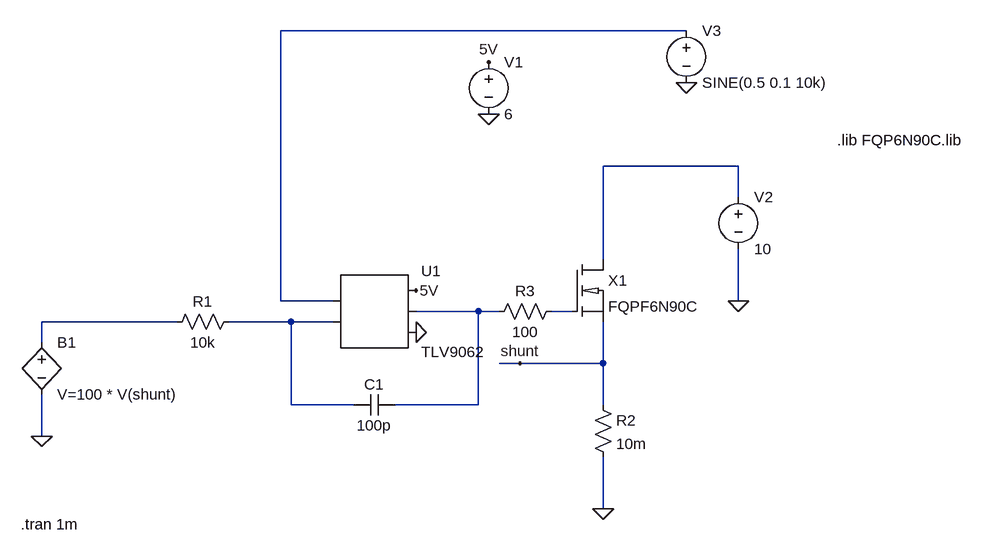
[diagram p0: schematic gate_drive.asc]
gate_drive.asc, the LTspice schematic file:
Version 4
SHEET 1 1172 680
WIRE 720 -256 96 -256
WIRE 800 -48 592 -48
WIRE 800 0 800 -48
WIRE 592 96 592 -48
WIRE 96 160 96 -256
WIRE 176 160 96 160
WIRE 800 160 800 80
WIRE 400 176 304 176
WIRE 432 176 400 176
WIRE 544 176 512 176
WIRE -64 192 -272 192
WIRE 112 192 16 192
WIRE 176 192 112 192
WIRE -272 224 -272 192
WIRE 464 256 432 256
WIRE 592 256 592 192
WIRE 592 256 464 256
WIRE 112 320 112 192
WIRE 208 320 112 320
WIRE 400 320 400 176
WIRE 400 320 272 320
WIRE 592 320 592 256
WIRE -272 368 -272 304
WIRE 592 480 592 400
FLAG 304 208 0
FLAG 304 144 5V
FLAG 416 -208 5V
FLAG 416 -128 0
FLAG 592 480 0
FLAG 800 160 0
FLAG 464 256 shunt
FLAG -272 368 0
FLAG 720 -176 0
SYMBOL AutoGenerated\\TLV9062 240 176 R0
SYMATTR InstName U1
SYMBOL voltage 416 -224 R0
WINDOW 123 0 0 Left 0
WINDOW 39 0 0 Left 0
SYMATTR InstName V1
SYMATTR Value 6
SYMBOL res 32 176 R90
WINDOW 0 0 56 VBottom 2
WINDOW 3 32 56 VTop 2
SYMATTR InstName R1
SYMATTR Value 10k
SYMBOL cap 272 304 R90
WINDOW 0 0 32 VBottom 2
WINDOW 3 32 32 VTop 2
SYMATTR InstName C1
SYMATTR Value 100p
SYMBOL res 576 304 R0
SYMATTR InstName R2
SYMATTR Value 10m
SYMBOL voltage 800 -16 R0
WINDOW 123 0 0 Left 0
WINDOW 39 0 0 Left 0
SYMATTR InstName V2
SYMATTR Value 10
SYMBOL bv -272 208 R0
SYMATTR InstName B1
SYMATTR Value V=100 * V(shunt)
SYMBOL voltage 720 -272 R0
WINDOW 123 0 0 Left 0
WINDOW 39 0 0 Left 0
SYMATTR InstName V3
SYMATTR Value SINE(0.5 0.1 10k)
SYMBOL n_channel_mosfet 544 96 R0
SYMATTR InstName X1
SYMBOL res 528 160 R90
WINDOW 0 0 56 VBottom 2
WINDOW 3 32 56 VTop 2
SYMATTR InstName R3
SYMATTR Value 100
TEXT -304 504 Left 2 !.tran 1m
TEXT 952 -88 Left 2 !.lib FQP6N90C.lib

The netlist it stands for:
* gate_drive.asc
* U1: TLV9062 (symbol AutoGenerated\TLV9062 not available, pins judged from their places): pin1=N001 pin2=N006 pin3=5V pin4=N003 pin5=0
V1 5V 0 6
R1 N006 N005 10k
C1 N003 N006 100p
R2 shunt 0 10m
V2 N002 0 10
B1 N005 0 V=100 * V(shunt)
V3 N001 0 SINE(0.5 0.1 10k)
XX1 N002 N004 shunt FQPF6N90C  ; pins D G S
R3 N004 N003 100
.tran 1m
.lib FQP6N90C.lib
.lib FQP6N90C.lib
.backanno
.end